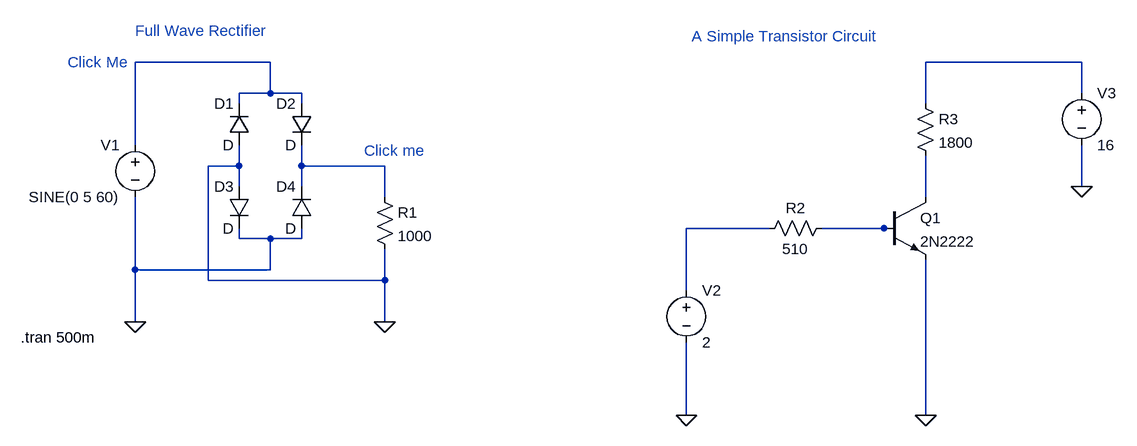
[diagram p0: schematic 05 Diodes and Transistors.asc]
05 Diodes and Transistors.asc, the LTspice schematic file:
Version 4
SHEET 1 1496 680
WIRE 80 48 -128 48
WIRE 1328 48 1088 48
WIRE 80 96 80 48
WIRE 80 96 32 96
WIRE 128 96 80 96
WIRE 1328 96 1328 48
WIRE 32 112 32 96
WIRE 128 112 128 96
WIRE 1088 112 1088 48
WIRE -128 176 -128 48
WIRE 32 208 32 176
WIRE 32 208 -16 208
WIRE 128 208 128 176
WIRE 256 208 128 208
WIRE 32 240 32 208
WIRE 128 240 128 208
WIRE 1328 240 1328 176
WIRE 256 256 256 208
WIRE 1088 256 1088 192
WIRE 848 304 720 304
WIRE 1024 304 928 304
WIRE 1040 304 1024 304
WIRE 32 320 32 304
WIRE 80 320 32 320
WIRE 128 320 128 304
WIRE 128 320 80 320
WIRE -128 368 -128 256
WIRE 80 368 80 320
WIRE 80 368 -128 368
WIRE -16 384 -16 208
WIRE 256 384 256 336
WIRE 256 384 -16 384
WIRE 720 400 720 304
WIRE -128 448 -128 368
WIRE 256 448 256 384
WIRE 720 592 720 480
WIRE 1088 592 1088 352
FLAG 256 448 0
FLAG -128 448 0
FLAG 1088 592 0
FLAG 720 592 0
FLAG 1328 240 0
SYMBOL diode 48 176 R180
WINDOW 0 24 64 Left 2
WINDOW 3 24 0 Left 2
SYMATTR InstName D1
SYMBOL diode 144 112 M0
SYMATTR InstName D2
SYMBOL diode 48 240 M0
SYMATTR InstName D3
SYMBOL diode 144 304 R180
WINDOW 0 24 64 Left 2
WINDOW 3 24 0 Left 2
SYMATTR InstName D4
SYMBOL voltage -128 160 M0
WINDOW 123 0 0 Left 0
WINDOW 39 0 0 Left 0
SYMATTR InstName V1
SYMATTR Value SINE(0 5 60)
SYMBOL res 240 240 R0
SYMATTR InstName R1
SYMATTR Value 1000
SYMBOL npn 1024 256 R0
SYMATTR InstName Q1
SYMATTR Value 2N2222
SYMBOL res 944 288 R90
WINDOW 0 0 56 VBottom 2
WINDOW 3 32 56 VTop 2
SYMATTR InstName R2
SYMATTR Value 510
SYMBOL res 1072 96 R0
SYMATTR InstName R3
SYMATTR Value 1800
SYMBOL voltage 720 384 R0
WINDOW 123 0 0 Left 0
WINDOW 39 0 0 Left 0
SYMATTR InstName V2
SYMATTR Value 2
SYMBOL voltage 1328 80 R0
WINDOW 123 0 0 Left 0
WINDOW 39 0 0 Left 0
SYMATTR InstName V3
SYMATTR Value 16
TEXT -304 472 Left 2 !.tran 500m
TEXT -128 0 Left 2 ;Full Wave Rectifier
TEXT 224 184 Left 2 ;Click me
TEXT -232 48 Left 2 ;Click Me
TEXT 728 8 Left 2 ;A Simple Transistor Circuit

The netlist it stands for:
* 05 Diodes and Transistors.asc
D1 0 N001 D
D2 N001 N003 D
D3 0 0 D
D4 0 N003 D
V1 N001 0 SINE(0 5 60)
R1 N003 0 1000
Q1 N004 N006 0 0 2N2222
R2 N006 N005 510
R3 N002 N004 1800
V2 N005 0 2
V3 N002 0 16
.model D D
.lib standard.dio
.model NPN NPN
.model PNP PNP
.lib standard.bjt
.tran 500m
* Full Wave Rectifier
* Click me
* Click Me
* A Simple Transistor Circuit
.backanno
.end